# EAGLE design Dual VCLFO CTRL (EAGLE 7.7.0)
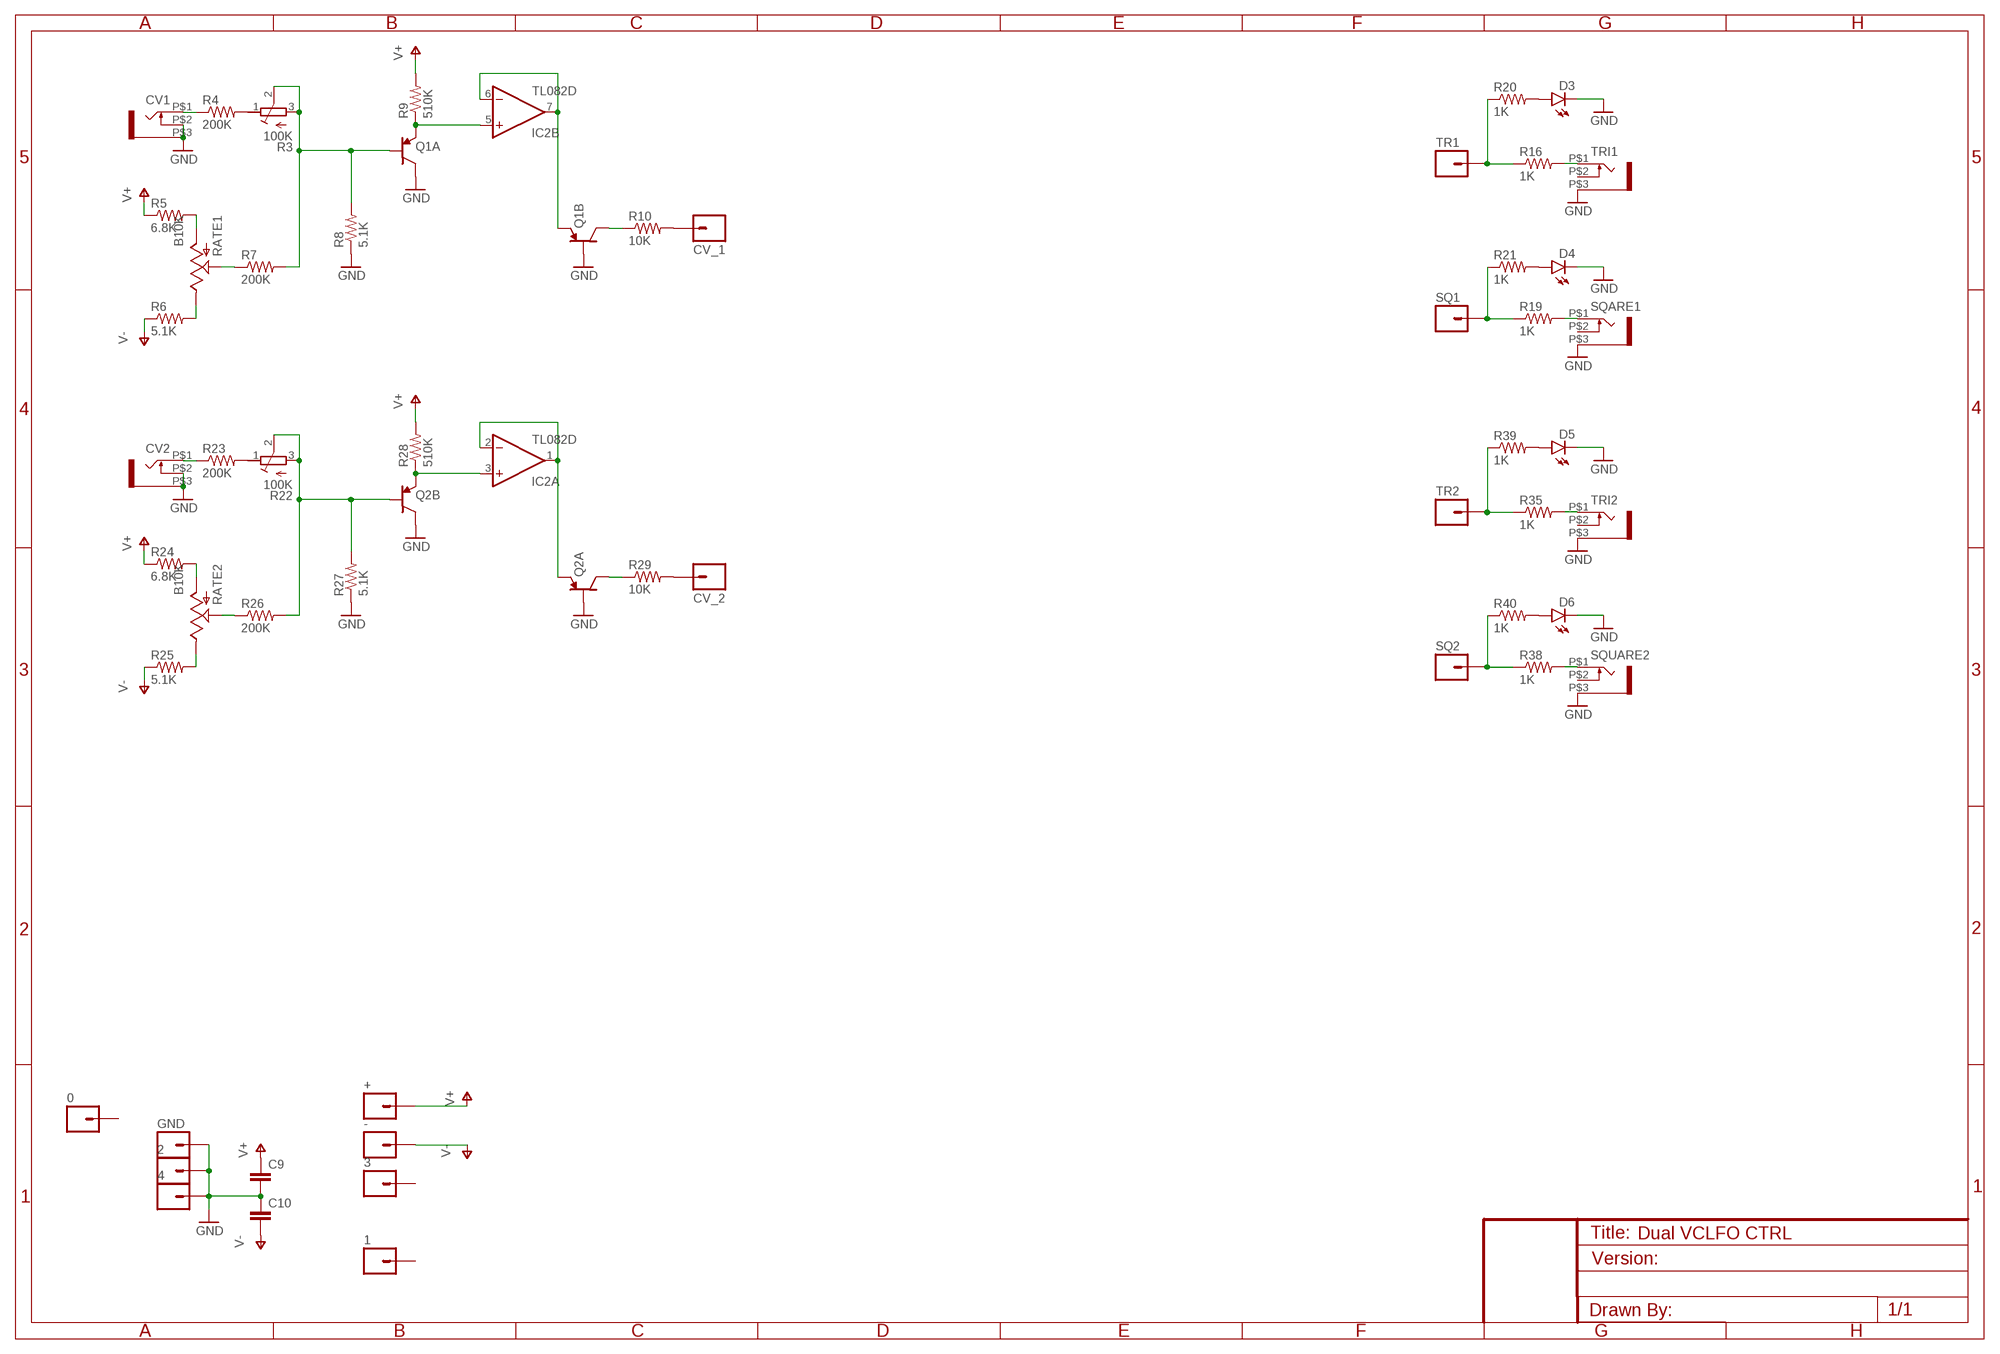
[diagram p0: schematic, sheet 1]

## Parts
0  M01PTH  [1X01]
1  M01PTH  [1X01]
2  M01PTH  [1X01]
3  M01PTH  [1X01]
4  M01PTH  [1X01]
+  M01PTH  [1X01]
-  M01PTH  [1X01]
C9  CAP0805  [0805]
C10  CAP0805  [0805]
CV1  WQP-PJ301M-12_JACK  [WQP-PJ301M-12_JACK]
CV2  WQP-PJ301M-12_JACK  [WQP-PJ301M-12_JACK]
CV_1  M01PTH  [1X01]
CV_2  M01PTH  [1X01]
D3  LED3MM  [LED3MM]
D4  LED3MM  [LED3MM]
D5  LED3MM  [LED3MM]
D6  LED3MM  [LED3MM]
GND  M01PTH  [1X01]
IC2  TL082D  [SO08]
Q1  PNP-DUALPMP5201  [SOT363]
Q2  PNP-DUALPMP5201  [SOT363]
R3  100K  R-TRIMM3314G  [RTRIM3314G]
R4  200K  RESISTOR0805-RES  [0805]
R5  6.8K  RESISTOR0805-RES  [0805]
R6  5.1K  RESISTOR0805-RES  [0805]
R7  200K  RESISTOR0805-RES  [0805]
R8  5.1K  RESISTOR0805-RES  [0805]
R9  510K  RESISTOR0805-RES  [0805]
R10  10K  RESISTOR0805-RES  [0805]
R16  1K  RESISTOR0805-RES  [0805]
R19  1K  RESISTOR0805-RES  [0805]
R20  1K  RESISTOR0805-RES  [0805]
R21  1K  RESISTOR0805-RES  [0805]
R22  100K  R-TRIMM3314G  [RTRIM3314G]
R23  200K  RESISTOR0805-RES  [0805]
R24  6.8K  RESISTOR0805-RES  [0805]
R25  5.1K  RESISTOR0805-RES  [0805]
R26  200K  RESISTOR0805-RES  [0805]
R27  5.1K  RESISTOR0805-RES  [0805]
R28  510K  RESISTOR0805-RES  [0805]
R29  10K  RESISTOR0805-RES  [0805]
R35  1K  RESISTOR0805-RES  [0805]
R38  1K  RESISTOR0805-RES  [0805]
R39  1K  RESISTOR0805-RES  [0805]
R40  1K  RESISTOR0805-RES  [0805]
RATE1  B10K  POT  [ALPS_POT]
RATE2  B10K  POT  [ALPS_POT]
SQ1  M01PTH  [1X01]
SQ2  M01PTH  [1X01]
SQARE1  WQP-PJ301M-12_JACK  [WQP-PJ301M-12_JACK]
SQUARE2  WQP-PJ301M-12_JACK  [WQP-PJ301M-12_JACK]
TR1  M01PTH  [1X01]
TR2  M01PTH  [1X01]
TRI1  WQP-PJ301M-12_JACK  [WQP-PJ301M-12_JACK]
TRI2  WQP-PJ301M-12_JACK  [WQP-PJ301M-12_JACK]

## Nets
GND: 2.1 4.1 C9.2 C10.1 CV1.P$2 CV1.P$3 CV2.P$2 CV2.P$3 D3.K(C) D4.K(C) D5.K(C) D6.K(C) GND.1 Q1.P$2 Q1.P$6 Q2.P$1 Q2.P$3 R8.1 R27.1 SQARE1.P$3 SQUARE2.P$3 TRI1.P$3 TRI2.P$3
N$1: Q1.P$1 R3.2(S) R3.3(A) R7.2 R8.2
N$2: IC2.5(B:+IN) Q1.P$5 R9.1
N$3: Q2.P$2 R22.2(S) R22.3(A) R26.2 R27.2
N$4: CV_1.1 R10.2
N$5: CV_2.1 R29.2
N$7: IC2.6(B:-IN) IC2.7(B:OUT) Q1.P$4
N$8: Q1.P$3 R10.1
N$11: R3.1(E) R4.2
N$12: CV1.P$1 R4.1
N$14: R5.2 RATE1.P$3(A)
N$15: R6.2 RATE1.P$1(E)
N$16: R7.1 RATE1.P$2(S)
N$24: R19.1 R21.1 SQ1.1
N$26: R16.1 R20.1 TR1.1
N$27: R22.1(E) R23.2
N$28: R16.2 TRI1.P$1
N$29: R19.2 SQARE1.P$1
N$30: D3.A R20.2
N$31: D4.A R21.2
N$32: CV2.P$1 R23.1
N$34: R24.2 RATE2.P$3(A)
N$35: R25.2 RATE2.P$1(E)
N$36: R26.1 RATE2.P$2(S)
N$37: IC2.3(A:+IN) Q2.P$4 R28.1
N$38: IC2.1(A:OUT) IC2.2(A:-IN) Q2.P$5
N$39: Q2.P$6 R29.1
N$46: R38.1 R40.1 SQ2.1
N$48: R35.1 R39.1 TR2.1
N$49: R35.2 TRI2.P$1
N$50: R38.2 SQUARE2.P$1
N$51: D5.A R39.2
N$52: D6.A R40.2
V+: +.1 C9.1 R5.1 R9.2 R24.1 R28.2
V-: -.1 C10.2 R6.1 R25.1
Unconnected: 0.1 1.1 3.1 SQARE1.P$2 SQUARE2.P$2 TRI1.P$2 TRI2.P$2

## Power pins joined to a net without a drawn wire
V+: IC2.8(P:V+)
V-: IC2.4(P:V-)

## Library data of the parts
0 1-4 + - CV_1 CV_2 GND SQ1 SQ2 TR1 TR2 = SparkFun-Connectors:M01: Header 1 Standard 1-pin 0.1" header. Use with straight break away headers (SKU : PRT-00116), right angle break away headers (PRT-00553), swiss pins (PRT-00743), machine pins (PRT-00117), and female headers (PRT-00115).
C9 C10 = SparkFun-Capacitors:CAP: Capacitor Standard 0603 ceramic capacitor, and 0.1" leaded capacitor.
CV1 CV2 SQARE1 SQUARE2 TRI1 TRI2 = thonkiconn:WQP-PJ301M-12_JACK
D3-D6 = SparkFun-LED:LED: LEDs Standard schematic elements and footprints for 5mm, 3mm, 1206, and 0603 sized LEDs. 5mm - Spark Fun Electronics SKU : COM-00529 (and others)
IC2 = linear:TL082: OP AMP Data sheet <http://www.ti.com/lit/ds/symlink/tl084a . pdf>; DATA_SHEET: <a href="http://www.ti.com/lit/ds/symlink/tl084a.pdf"> Data sheet </a>
Q1 Q2 = audioint:PNP-DUAL
R3 R22 = rcl:R-TRIMM: Trimm resistor
R4-R10 R16 R19-R21 R23-R29 R35 R38-R40 = SparkFun-Passives:RESISTOR: Resistor Basic schematic elements and footprints for 0603, 1206, and PTH resistors.
RATE1 RATE2 = SparkFun-Electromechanical:POT; PROD_ID: RES-09177

## Board
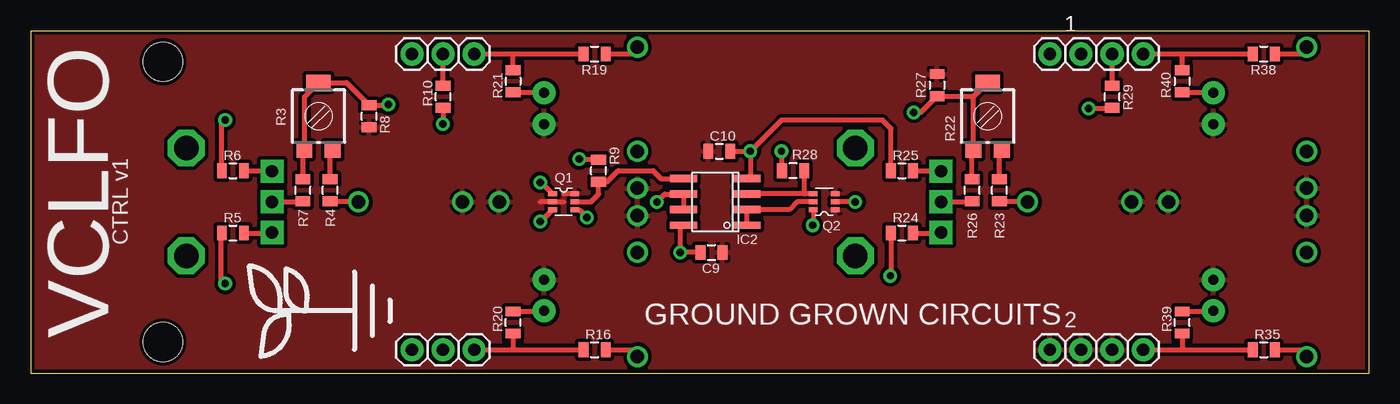
[diagram p1: board, top side]
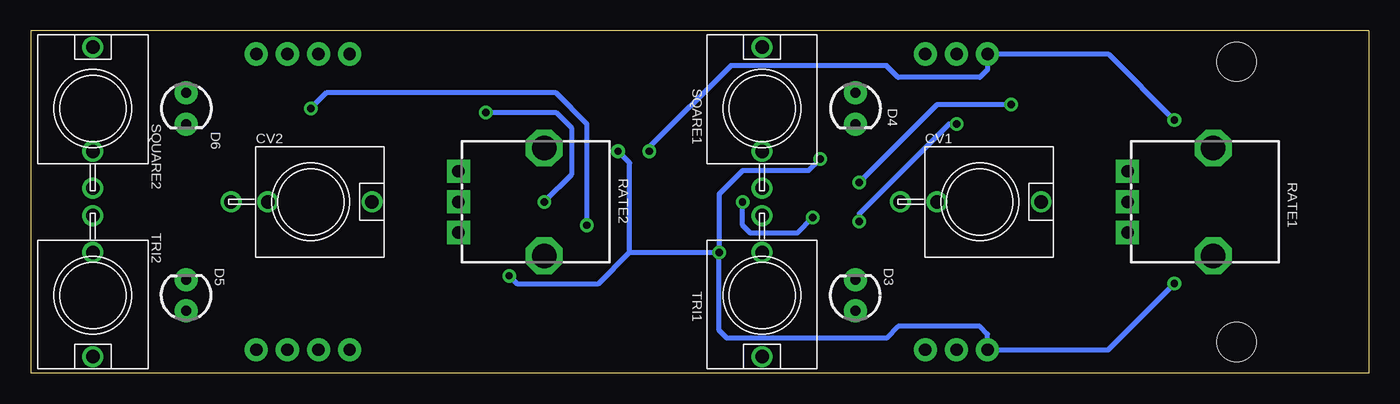
[diagram p2: board, bottom side, seen from below]

Size 109.22 x 27.94 mm. Coordinates in mm from the lower left corner, seen from the top.
Outline: 0,0 109.22,0 109.22,27.94 0,27.94 0,0
Copper layers (1*16): Top 0.035mm / dielectric 1.5mm / Bottom 0.035mm
Design rules "SparkFun": minimum track width 8mil, minimum drill 20mil, track to track 8mil, track to pad 8mil, pad to pad 8mil, via to via 8mil, smd to smd 8mil, copper to edge 8mil, drill to drill 8mil, minimum pad ring 12mil, minimum via ring 10mil, stop-mask expansion 4mil, vias tented up to drill 20mil, thermal gap 10mil
Holes 3.2 mm at 10.79,25.4 10.79,2.54

### Footprints (pad centres in the part's own frame; a part is rotated, then mirrored left to right if it is on the bottom)
1X01 = drill 1.016 pad 1.88: 1 0,0
0805 = smd 0.8 x 1.2: 1 -0.9,0; 2 0.9,0
WQP-PJ301M-12_JACK = drill 1.1: P$1 0,5; P$2 0,-3.5; P$3 0,-6.5
LED3MM = drill 0.813 pad 1.88: A -1.27,0; K 1.27,0
SO08 = smd 0.6 x 2.2: 1 -1.905,-2.6; 2 -0.635,-2.6; 3 0.635,-2.6; 4 1.905,-2.6; 5 1.905,2.6; 6 0.635,2.6; 7 -0.635,2.6; 8 -1.905,2.6
SOT363 = smd 0.42 x 0.7: P$1 -0.65,-0.9; P$2 0,-0.9; P$3 0.65,-0.9; P$4 0.65,0.9; P$5 0,0.9; P$6 -0.65,0.9
RTRIM3314G = smd 1.3 x 1.3: 1 1.15,-2.75; 3 -1.15,-2.75 | smd 2 x 1.3: 2 0,2.75
ALPS_POT = drill 1 pad 1.88 square: P$1 7,-2.5; P$2 7,0; P$3 7,2.5 | drill 2 octagon: P$4 0,-4.4; P$5 0,4.4

### Placement (x,y rotation side)
0  33.66,1.91 0 top
1  83.19,26.04 0 top
2  83.19,1.91 0 top
3  85.72,26.04 180 top
4  85.72,1.91 0 top
+  31.11,1.91 0 top
-  31.11,26.04 180 top
C9  55.56,9.84 0 top
C10  56.2,18.1 0 top
CV1  31.75,13.97 270 bottom
CV2  86.36,13.97 270 bottom
CV_1  33.66,26.04 90 top
CV_2  88.27,26.04 90 top
D3  41.91,6.35 90 bottom
D4  41.91,21.59 270 bottom
D5  96.52,6.35 90 bottom
D6  96.52,21.59 270 bottom
GND  88.27,1.91 0 top
IC2  55.88,13.97 90 top
Q1  43.5,13.97 270 top
Q2  64.77,13.97 90 top
R3  23.5,20.95 0 top
R4  24.45,14.92 90 top
R5  16.51,11.43 0 top
R6  16.51,16.51 0 top
R7  22.23,14.92 90 top
R8  27.62,20.95 90 top
R9  46.35,16.51 90 top
R10  33.66,22.54 90 top
R16  46.04,1.91 0 top
R19  46.04,26.04 0 top
R20  39.37,4.13 90 top
R21  39.37,23.81 270 top
R22  78.11,20.95 0 top
R23  79.06,14.92 90 top
R24  71.12,11.43 0 top
R25  71.12,16.51 0 top
R26  76.83,14.92 90 top
R27  73.98,23.5 270 top
R28  62.23,16.51 180 top
R29  88.27,22.54 90 top
R35  100.65,1.91 0 top
R38  100.65,26.04 0 top
R39  93.98,4.13 90 top
R40  93.98,23.81 270 top
RATE1  12.7,13.97 180 bottom
RATE2  67.31,13.97 180 bottom
SQ1  36.2,26.04 180 top
SQ2  90.81,26.04 180 top
SQARE1  49.53,21.59 0 bottom
SQUARE2  104.14,21.59 0 bottom
TR1  36.2,1.91 0 top
TR2  90.81,1.91 0 top
TRI1  49.53,6.35 180 bottom
TRI2  104.14,6.35 180 bottom
U$1  [LOGO_MED]  26.35,5.08 90 top

### Tracks (layer width: path | path; a pad name or v marks a point on that pad's centre or on a via)
GND
  Top 0.406: 41.59,13.97 Q1.P$2 43.5,13.97 | Q1.P$6 43.51,14.62 43.5,14.61
  pour Top (isolate 0.305): 0,0 109.22,0 109.22,27.94 0,27.94
N$1  (via drill 0.6)
  Top 0.406: R7.2 22.23,18.09 R3.3 22.34,22.55 R3.2 25.77,23.7 R8.2 29.16,21.86 v29.21,21.91 | v41.59,15.56 41.66,15.56 Q1.P$1
  Bottom 0.406: v29.21,21.91 35.24,21.91 v41.59,15.56
N$2
  Top 0.406: Q1.P$5 45.72,13.97 46.35,14.61 R9.1 47.04,15.61 47.94,16.51 50.8,16.51 51.44,15.88 IC2.5
N$3  (via drill 0.6)
  Top 0.406: R26.2 76.83,18.09 R22.3 76.95,22.55 | 76.95,22.55 R22.2 | v67.31,13.97 Q2.P$2 | v72.07,21.27 72.66,21.27 R27.2 76.92,22.59 76.95,22.55
  Bottom 0.406: v72.07,21.27 66.36,21.27 65.09,20 65.09,16.19 v67.31,13.97
N$4
  Top 0.406: R10.2 CV_1.1
N$5
  Top 0.406: R29.2 CV_2.1
N$7  (via drill 0.6)
  Top 0.406: IC2.7 IC2.6 51.75,14.61 v51.12,13.97 | Q1.P$4 44.78,13.32 v45.4,12.7
  Bottom 0.406: v45.4,12.7 46.67,11.43 50.48,11.43 51.12,12.06 v51.12,13.97
N$8  (via drill 0.6)
  Top 0.406: R10.1 v33.66,20.32 | 42.58,13.34 Q1.P$3 41.66,12.38 v41.59,12.38
  Bottom 0.406: v33.66,20.32 34.29,20.32 41.59,13.02 v41.59,12.38
N$11
  Top 0.406: R4.2 24.45,18.01 R3.1
N$12
  Top 0.406: CV1.P$1 24.5,13.97 R4.1
N$14
  Top 0.406: R5.2 19.66,11.43 RATE1.P$3
N$15
  Top 0.406: R6.2 19.66,16.51 RATE1.P$1
N$16
  Top 0.406: RATE1.P$2 22.17,13.97 R7.1
N$24
  Top 0.406: SQ1.1 39.37,26.04 | 39.37,26.04 R19.1 | R21.1 39.37,26.04
N$26
  Top 0.406: TR1.1 39.37,1.91 | 39.37,1.91 R16.1 | R20.1 39.37,1.91
N$27
  Top 0.406: R23.2 79.06,18.01 R22.1
N$28
  Top 0.406: R16.2 48.98,1.91 TRI1.P$1
N$29
  Top 0.406: R19.2 48.98,26.04 SQARE1.P$1
N$30
  Top 0.406: R20.2 41.86,5.03 D3.A
N$31
  Top 0.406: R21.2 41.86,22.91 D4.A
N$32
  Top 0.406: CV2.P$1 79.11,13.97 R23.1
N$34
  Top 0.406: R24.2 74.27,11.43 RATE2.P$3
N$35
  Top 0.406: R25.2 74.27,16.51 RATE2.P$1
N$36
  Top 0.406: RATE2.P$2 76.78,13.97 R26.1
N$37
  Top 0.406: Q2.P$4 63.18,14.62 | 63.18,14.62 58.49,14.62 IC2.3 | R28.1 63.13,14.67 63.18,14.62
N$38
  Top 0.406: Q2.P$5 62.55,13.97 61.91,13.34 IC2.2 IC2.1
N$39  (via drill 0.6)
  Top 0.406: Q2.P$6 63.87,12.12 v63.82,12.06 | v86.36,21.59 88.21,21.59 R29.1
  Bottom 0.406: v63.82,12.06 63.82,20.32 66.36,22.86 85.09,22.86 v86.36,21.59
N$46
  Top 0.406: SQ2.1 93.98,26.04 | 93.98,26.04 R38.1 | R40.1 93.98,26.04
N$48
  Top 0.406: TR2.1 93.98,1.91 | 93.98,1.91 R35.1 | R39.1 93.98,1.91
N$49
  Top 0.406: R35.2 103.58,1.91 TRI2.P$1
N$50
  Top 0.406: R38.2 103.58,26.04 SQUARE2.P$1
N$51
  Top 0.406: R39.2 96.47,5.03 D5.A
N$52
  Top 0.406: R40.2 96.47,22.91 D6.A
V+  (via drill 0.6)
  Top 0.406: v15.88,7.3 15.56,7.62 15.56,11.38 R5.1 | IC2.8 53.02,11.81 v53.02,9.84 C9.1 | R9.2 44.82,17.41 v44.77,17.46 | R24.1 70.22,7.99 v70.17,7.94 | v61.28,18.1 61.28,16.56 R28.2
  Bottom 0.406: v15.88,7.3 21.27,1.91 +.1 31.11,3.17 31.75,3.81 38.42,3.81 39.37,2.86 52.39,2.86 53.02,3.49 v53.02,9.84 | v44.77,17.46 45.72,16.51 51.12,16.51 53.02,14.61 v53.02,9.84 | v70.17,7.94 69.53,7.3 62.87,7.3 60.33,9.84 | 60.33,9.84 v53.02,9.84 | 60.33,9.84 60.33,17.14 v61.28,18.1
V-  (via drill 0.6)
  Top 0.406: v15.88,20.64 15.56,20.32 15.56,16.56 R6.1 | v58.74,18.1 58.74,16.13 IC2.4 | C10.2 v58.74,18.1 | R25.1 70.22,19.95 69.53,20.64 61.28,20.64 v58.74,18.1
  Bottom 0.406: v15.88,20.64 21.27,26.04 -.1 31.11,24.77 31.75,24.13 38.42,24.13 39.37,25.08 52.07,25.08 58.74,18.41 v58.74,18.1

### Text on the board
tPlace: CTRL v1 | GROUND GROWN CIRCUITS | VCLFO